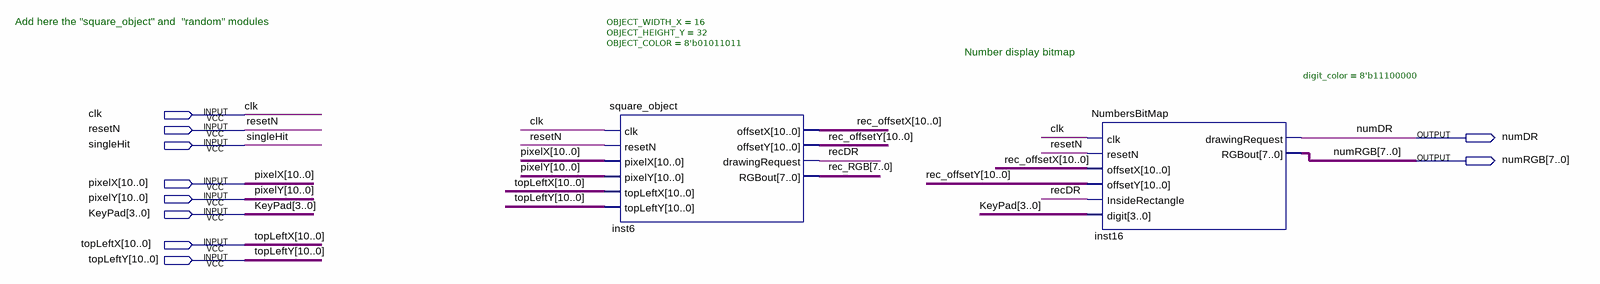
[diagram p0: schematic sheet]
// Quartus schematic NUMBER_DISPLAY.bdf as structural Verilog: 2 symbols, 10 pins
module NUMBER_DISPLAY (
  input  clk,
  input  resetN,
  input  singleHit,
  input  [10:0] pixelX,
  input  [10:0] pixelY,
  input  [3:0] KeyPad,
  input  [10:0] topLeftX,
  input  [10:0] topLeftY,
  output numDR,
  output [7:0] numRGB
);

  wire recDR;
  wire [7:0] rec_RGB;
  wire [10:0] rec_offsetX, rec_offsetY;

  square_object #(.OBJECT_WIDTH_X(16), .OBJECT_HEIGHT_Y(32), .OBJECT_COLOR(8'b01011011)) inst6 (
    .clk(clk), .resetN(resetN), .pixelX(pixelX), .pixelY(pixelY), .topLeftX(topLeftX), .topLeftY(topLeftY),
    .offsetX(rec_offsetX), .offsetY(rec_offsetY), .drawingRequest(recDR), .RGBout(rec_RGB));
  NumbersBitMap #(.digit_color(8'b11100000)) inst16 (
    .clk(clk), .resetN(resetN), .offsetX(rec_offsetX), .offsetY(rec_offsetY), .InsideRectangle(recDR),
    .digit(KeyPad), .drawingRequest(numDR), .RGBout(numRGB));

  // Notes on the sheet:
  //   Add here the "square_object" and  "random" modules
  //   Number display bitmap
endmodule
